# EAGLE design Brain Conn Disconnect (12 - straight) (EAGLE 9.6.2)
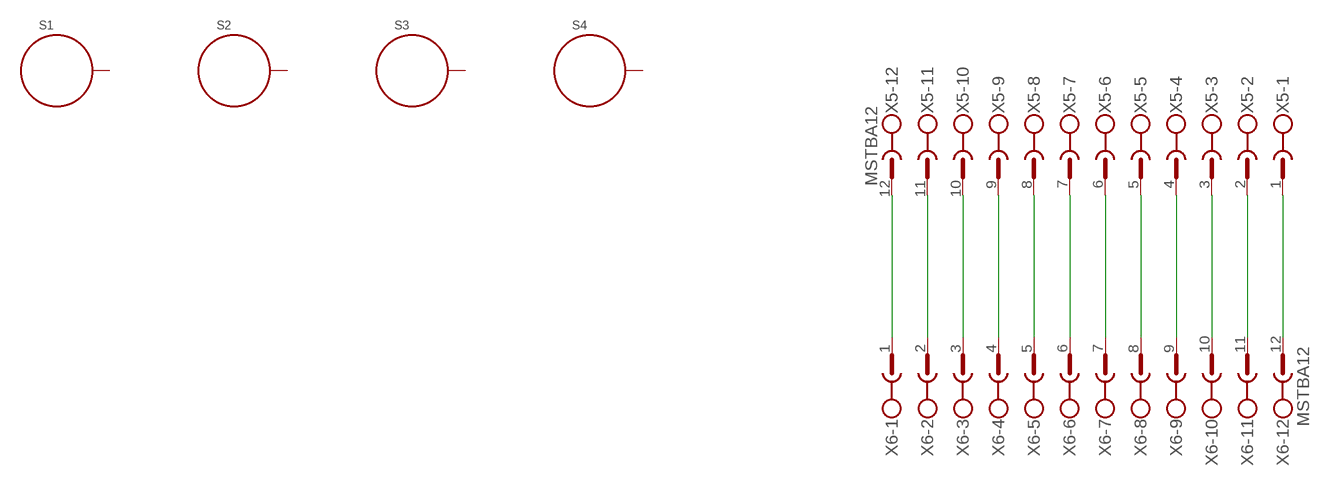
[diagram p0: schematic, sheet 1]

## Parts
S1  STANDOFF_ELECTRICAL144  [STANDOFF_ELECTRICAL_144MILL_NORMAL_SCREW]
S2  STANDOFF_ELECTRICAL144  [STANDOFF_ELECTRICAL_144MILL_NORMAL_SCREW]
S3  STANDOFF_ELECTRICAL144  [STANDOFF_ELECTRICAL_144MILL_NORMAL_SCREW]
S4  STANDOFF_ELECTRICAL144  [STANDOFF_ELECTRICAL_144MILL_NORMAL_SCREW]
X5  MSTBA12  [MSTBA12]
X6  MSTBA12  [MSTBA12]

## Nets
N$1: X5.12 X6.1
N$2: X5.11 X6.2
N$3: X5.10 X6.3
N$4: X5.9 X6.4
N$5: X5.8 X6.5
N$6: X5.7 X6.6
N$7: X5.6 X6.7
N$8: X5.5 X6.8
N$9: X5.4 X6.9
N$10: X5.3 X6.10
N$11: X5.2 X6.11
N$12: X5.1 X6.12
Unconnected: S1.P1 S2.P1 S3.P1 S4.P1

## Library data of the parts
S1-S4 = th_libraries:STANDOFF_ELECTRICAL: A standoff intended to be an electrically connected point. Pad size and stop size allow for a #8 Phillips pan screw head to make a solid connection to the board. Added 144mill drill hole that fits my normal wood screw
X5 X6 = con-phoenix-508:MSTBA12: PHOENIX; MPN: 1757349; OC_FARNELL: 3705250; OC_NEWARK: 71C4169

## Board
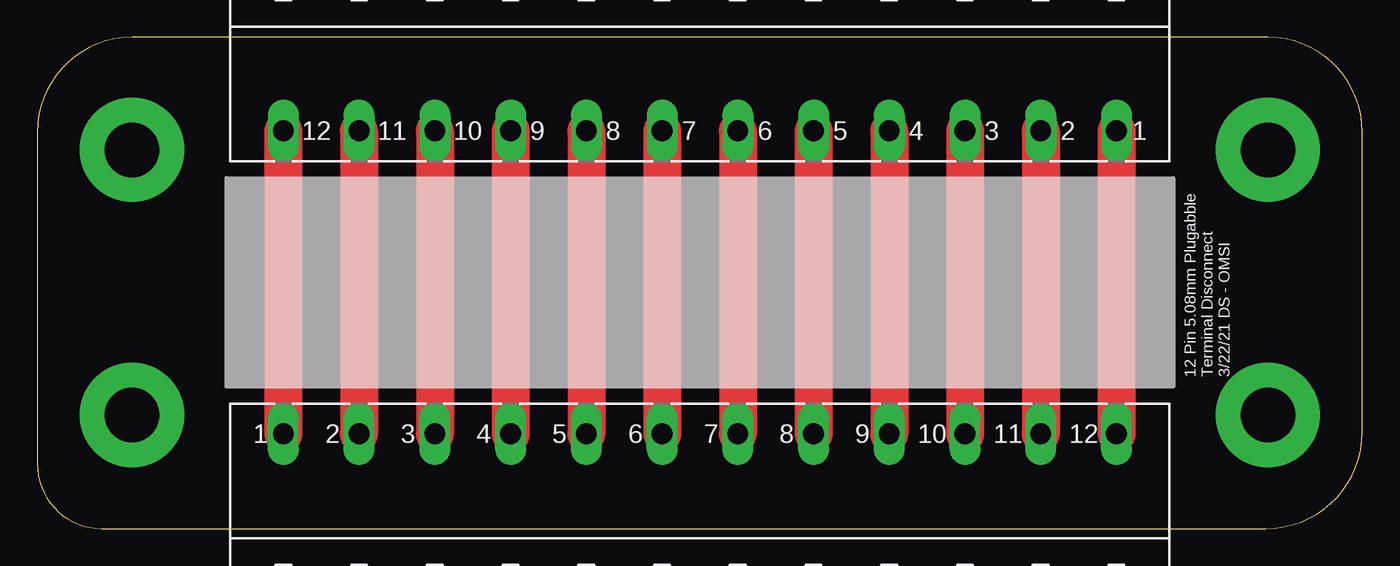
[diagram p1: board, top side]

Size 88.88 x 32.94 mm. Coordinates in mm from the lower left corner, seen from the top.
Outline: 88.88,6.47 88.88,26.6 arc90 82.54,32.94 6.37,32.94 arc90 0,26.57 0,4.34 arc90 4.34,0 82.41,0 arc90 88.88,6.47
Copper layers (1*16): Top 0.035mm / dielectric 1.5mm / Bottom 0.035mm
Design rules "default": minimum track width 6mil, minimum drill 0.35mm, track to track 6mil, track to pad 6mil, pad to pad 6mil, via to via 6mil, smd to smd 6mil, copper to edge 40mil, drill to drill 6mil, minimum pad ring 10mil, minimum via ring 8mil, stop-mask expansion 4mil, vias tented up to drill 0mil, thermal gap 10mil

### Footprints (pad centres in the part's own frame; a part is rotated, then mirrored left to right if it is on the bottom)
STANDOFF_ELECTRICAL_144MILL_NORMAL_SCREW = drill 3.658 pad 6.985: P1 0,0
MSTBA12 = drill 1.397 long: 1 -27.94,5.08; 2 -22.86,5.08; 3 -17.78,5.08; 4 -12.7,5.08; 5 -7.62,5.08; 6 -2.54,5.08; 7 2.54,5.08; 8 7.62,5.08; 9 12.7,5.08; 10 17.78,5.08; 11 22.86,5.08; 12 27.94,5.08

### Placement (x,y rotation side)
S1  6.35,7.62 0 top
S2  6.35,25.4 0 top
S3  82.55,7.62 0 top
S4  82.55,25.4 0 top
X5  44.45,1.27 0 top
X6  44.45,31.75 180 top

### Tracks (layer width: path | path; a pad name or v marks a point on that pad's centre or on a via)
N$1
  Top 2.54: X6.1 X5.12
N$2
  Top 2.54: X6.2 X5.11
N$3
  Top 2.54: X6.3 X5.10
N$4
  Top 2.54: X6.4 X5.9
N$5
  Top 2.54: X6.5 X5.8
N$6
  Top 2.54: X6.6 X5.7
N$7
  Top 2.54: X6.7 X5.6
N$8
  Top 2.54: X6.8 X5.5
N$9
  Top 2.54: X6.9 X5.4
N$10
  Top 2.54: X6.10 X5.3
N$11
  Top 2.54: X6.11 X5.2
N$12
  Top 2.54: X6.12 X5.1

### Text on the board
tPlace: 12 Pin 5.08mm Plugabble / Terminal Disconnect / 3/22/21 DS - OMSI | OMSI Brain Basics / Disconnect Board / 3-22-21 DS